# EAGLE design antenna_analyzer_rev7 (EAGLE 7.3.0)
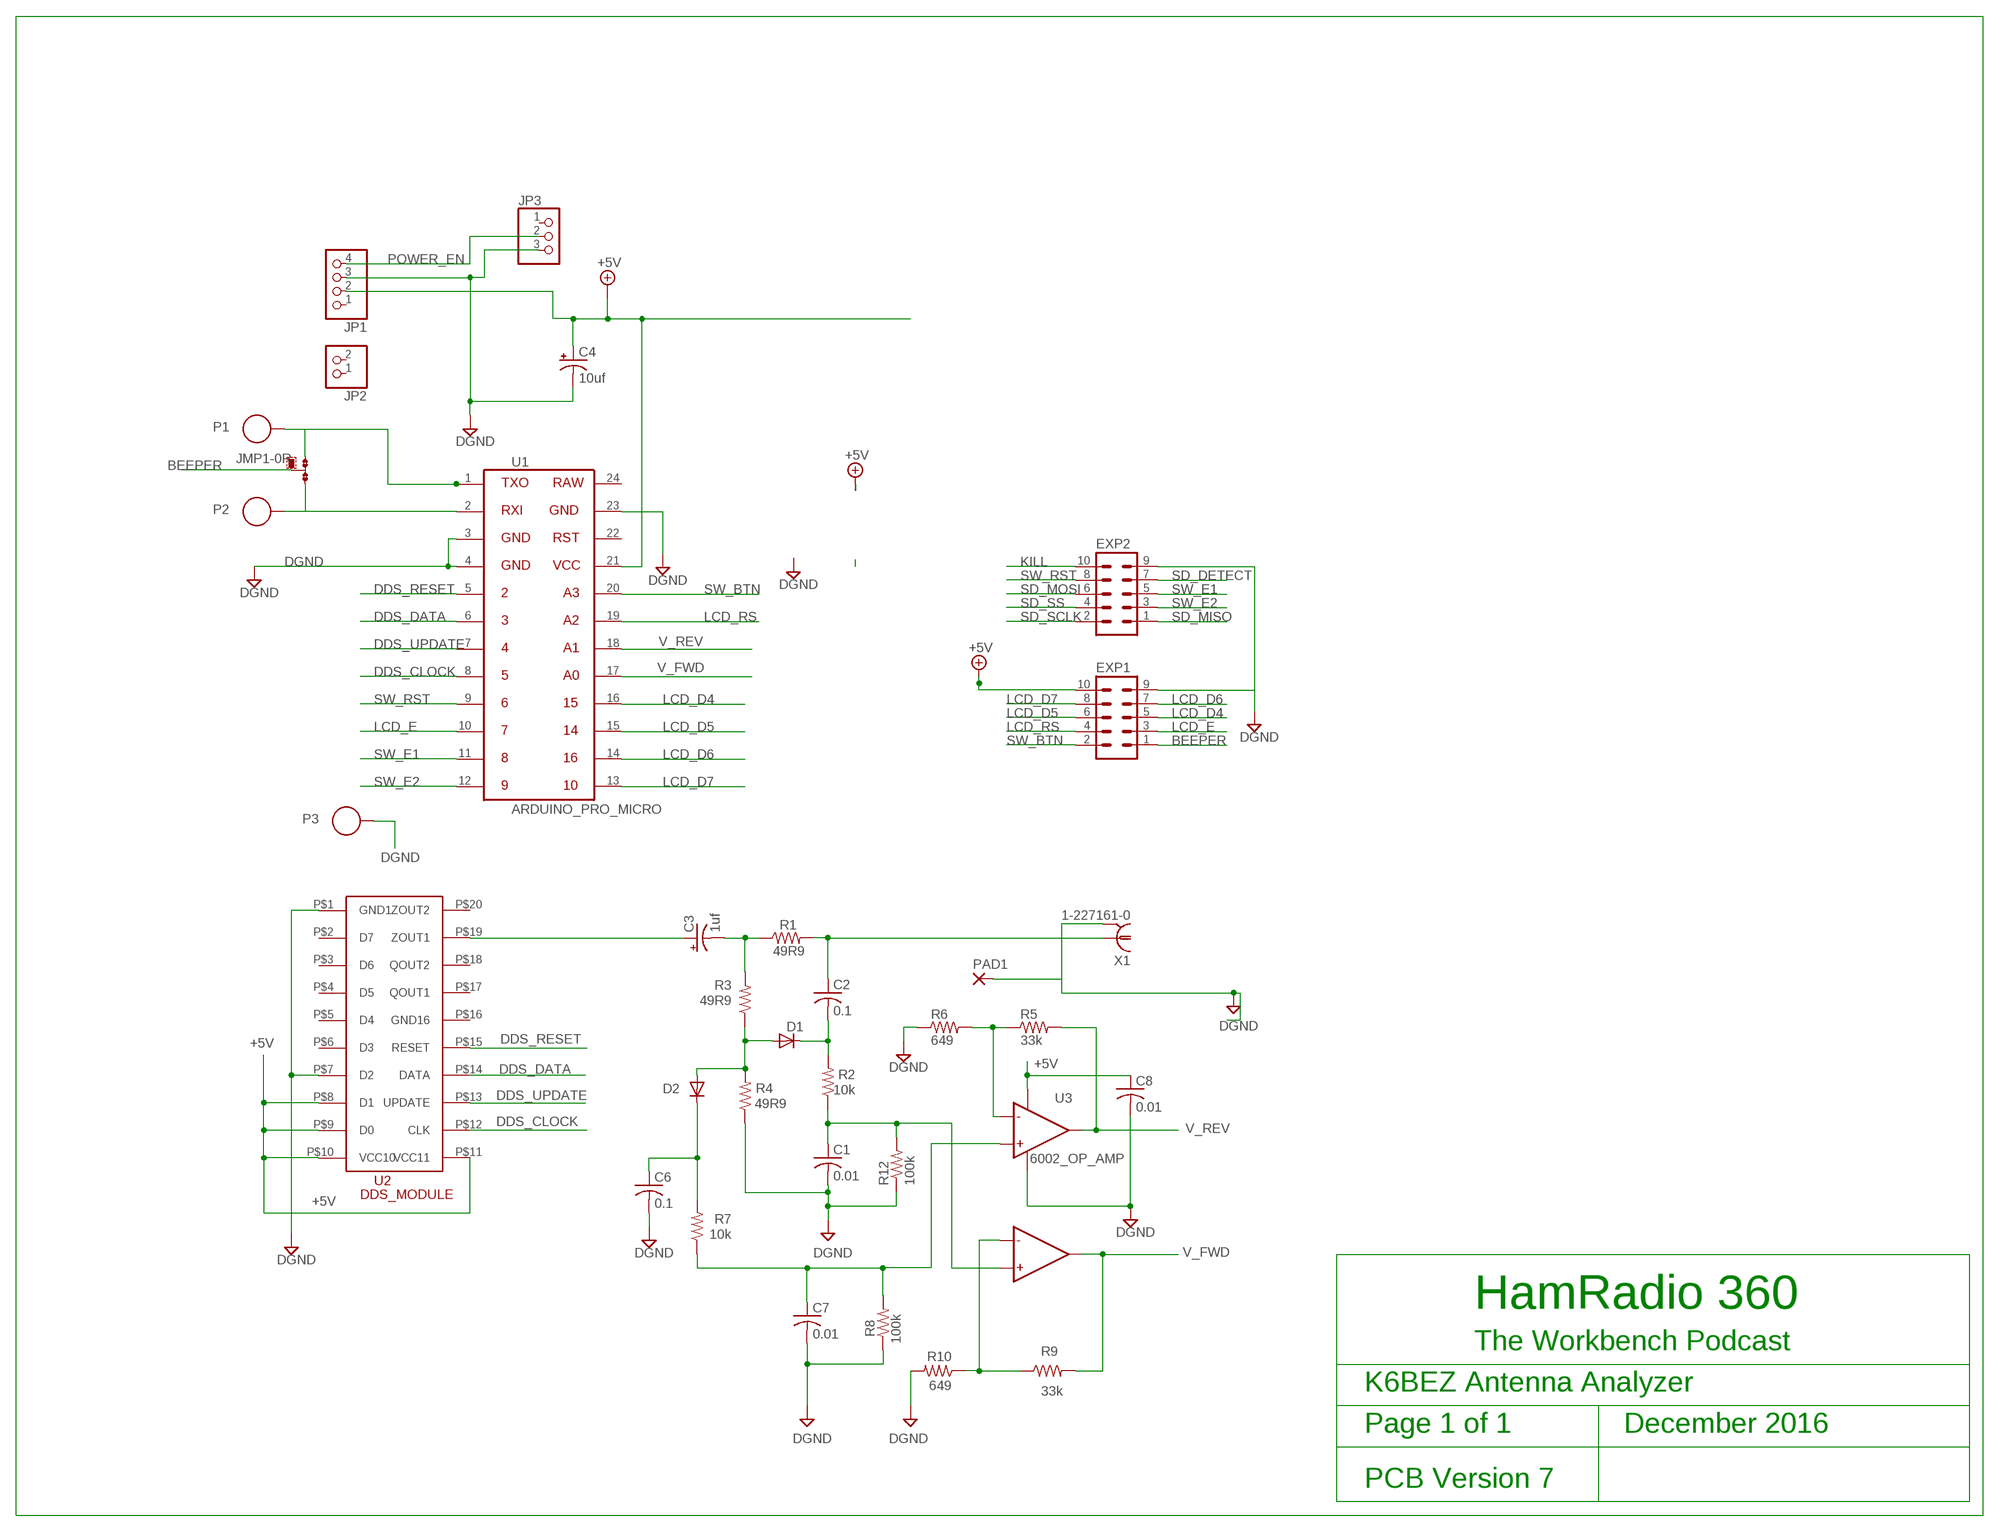
[diagram p0: schematic, sheet 1]

## Parts
C1  0.01  C-US025-025X050  [C025-025X050]
C2  0.1  C-US025-025X050  [C025-025X050]
C3  1uf  CPOL-USE1.8-4  [E1,8-4]
C4  10uf  CPOL-USE1.8-4  [E1,8-4]
C6  0.1  C-US025-025X050  [C025-025X050]
C7  0.01  C-US025-025X050  [C025-025X050]
C8  0.01  C-US025-025X050  [C025-025X050]
D1  AA143  1N4148DO35-7  [DO35-7]
D2  AA143  1N4148DO35-7  [DO35-7]
EXP1  MA05-2  [MA05-2]
EXP2  MA05-2  [MA05-2]
JMP1  0R-JUMPA  [A0R-JMP]
JP1  PINHD-1X4  [1X04]
JP2  PINHD-1X2  [1X02]
JP3  PINHD-1X3  [1X03]
P1  SOLDER_PAD_35_HOLE  [SOLDER_PAD_35_HOLE]
P2  SOLDER_PAD_35_HOLE  [SOLDER_PAD_35_HOLE]
P3  SOLDER_PAD_35_HOLE  [SOLDER_PAD_35_HOLE]
PAD1  1,6/0,9  [1,6/0,9]
R1  49R9  R-US_0207/10  [0207/10]
R2  10k  R-US_0207/10  [0207/10]
R3  49R9  R-US_0207/10  [0207/10]
R4  49R9  R-US_0207/10  [0207/10]
R5  33k  R-US_0207/10  [0207/10]
R6  649  R-US_0207/10  [0207/10]
R7  10k  R-US_0207/10  [0207/10]
R8  100k  R-US_0207/10  [0207/10]
R9  33k  R-US_0207/10  [0207/10]
R10  649  R-US_0207/10  [0207/10]
R12  100k  R-US_0207/10  [0207/10]
U1  ARDUINO_PRO_MICRO  [ARDUINO_PRO_MICRO]
U2  AD9850_MOD  [DDS_DIL]
U3  6002_OP_AMP  [OP_AMP_8_PIN]
X1  1-227161-0  [AMP_227161]

## Nets
+5V: C4.+ C8.1 EXP1.10 JP1.2 U1.21 U2.P$8(D1) U2.P$9(D0) U2.P$10(VCC10) U2.P$11(VCC11) U3.8(VCC+)
BEEPER: EXP1.1 JMP1.2
DDS_CLOCK: U1.8 U2.P$12(CLK)
DDS_DATA: U1.6 U2.P$14(DATA)
DDS_RESET: U1.5 U2.P$15(RESET)
DDS_UPDATE: U1.7 U2.P$13(UPDATE)
DGND: C1.2 C4.- C6.2 C7.2 C8.2 EXP1.9 EXP2.9 JP1.3 JP3.3 P3.1 PAD1.1(P) R4.1 R6.1 R8.1 R10.2 R12.1 U1.3 U1.4 U1.23 U2.P$1(GND1) U2.P$7(D2) U3.4(VCC-) X1.2
KILL: EXP2.10
LCD_D4: EXP1.5 U1.16
LCD_D5: EXP1.6 U1.15
LCD_D6: EXP1.7 U1.14
LCD_D7: EXP1.8 U1.13
LCD_E: EXP1.3 U1.10
LCD_RS: EXP1.4 U1.19
N$1: JMP1.1 P1.1 U1.1
N$2: C6.1 D2.C R7.2
N$3: C3.+ U2.P$19(ZOUT1)
N$5: C3.- R1.1 R3.2
N$6: D1.A D2.A R3.1 R4.2
N$7: C2.1 R1.2 X1.1
N$8: JMP1.3 P2.1 U1.2
N$9: C2.2 D1.C R2.2
N$10: C1.1 R2.1 R12.2 U3.5(IN+2)
N$11: C7.1 R7.1 R8.2 U3.3(IN+1)
N$13: R9.1 R10.1 U3.6(IN-2)
N$17: R5.1 R6.2 U3.2(IN-1)
POWER_EN: JP1.4 JP3.2
SD_DETECT: EXP2.7
SD_MISO: EXP2.1
SD_MOSI: EXP2.6
SD_SCLK: EXP2.2
SD_SS: EXP2.4
SW_BTN: EXP1.2 U1.20
SW_E1: EXP2.5 U1.11
SW_E2: EXP2.3 U1.12
SW_RST: EXP2.8 U1.9
V_FWD: R9.2 U1.17 U3.7(OUT2)
V_REV: R5.2 U1.18 U3.1(OUT1)
Unconnected: JP1.1 JP2.1 JP2.2 JP3.1 U1.22 U1.24 U2.P$2(D7) U2.P$3(D6) U2.P$4(D5) U2.P$5(D4) U2.P$6(D3) U2.P$16(GND16) U2.P$17(QOUT1) U2.P$18(QOUT2) U2.P$20(ZOUT2)

## Notes on the sheet
- HamRadio 360
- The Workbench Podcast
- K6BEZ Antenna Analyzer
- Page 1 of 1              December 2016
- PCB Version 7

## Library data of the parts
C1 C2 C6-C8 = resistor:C-US: CAPACITOR, American symbol
C3 C4 = resistor:CPOL-US: POLARIZED CAPACITOR, American symbol
D1 D2 = diode:1N4148: DIODE high speed (Philips)
EXP1 EXP2 = con-lstb:MA05-2: PIN HEADER; OC_FARNELL: unknown; OC_NEWARK: unknown
JMP1 = jump-0r-smd:0R-JUMP: SMD 0R 0805 Jumper
JP1 = pinhead:PINHD-1X4: PIN HEADER
JP2 = pinhead:PINHD-1X2: PIN HEADER
JP3 = adafruit:PINHD-1X3: PIN HEADER
P1-P3 = srs_lib_4:SOLDER_PAD_35_HOLE
PAD1 = wirepad:1,6/0,9: THROUGH-HOLE PAD
R1-R10 R12 = adafruit:R-US_: RESISTOR, American symbol
U1 = srs_lib_4:ARDUINO_PRO_MICRO
U2 = BericLib:AD9850_MOD
U3 = srs_lib_4:6002_OP_AMP
X1 = con-coax:?227161*: JACK, RIGHT ANGLE, 50 OHM, PCB, BNC Source: amp_227161.pdf; MF: TYCO ELECTRONICS; MPN: 1-227161; OC_FARNELL: unknown; OC_NEWARK: 33B3200

## Board
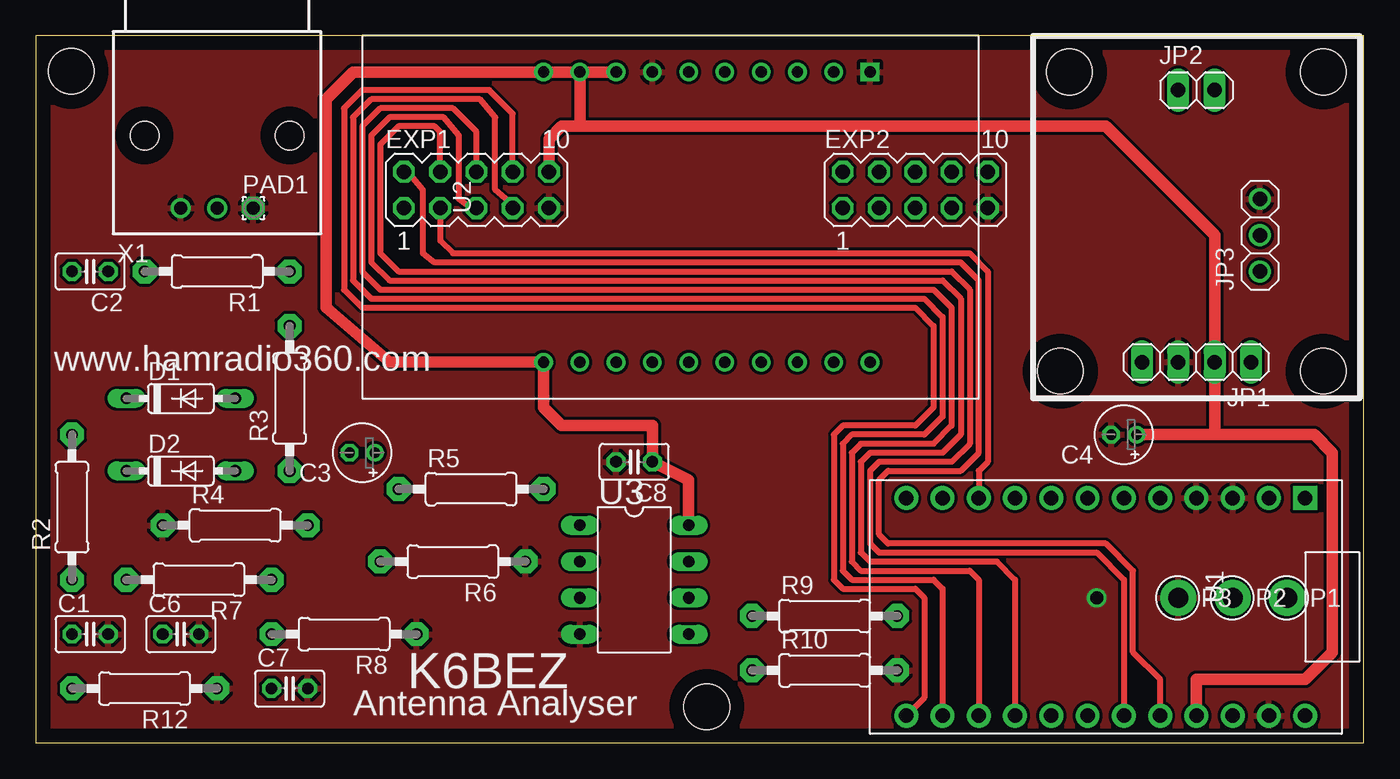
[diagram p1: board, top side]
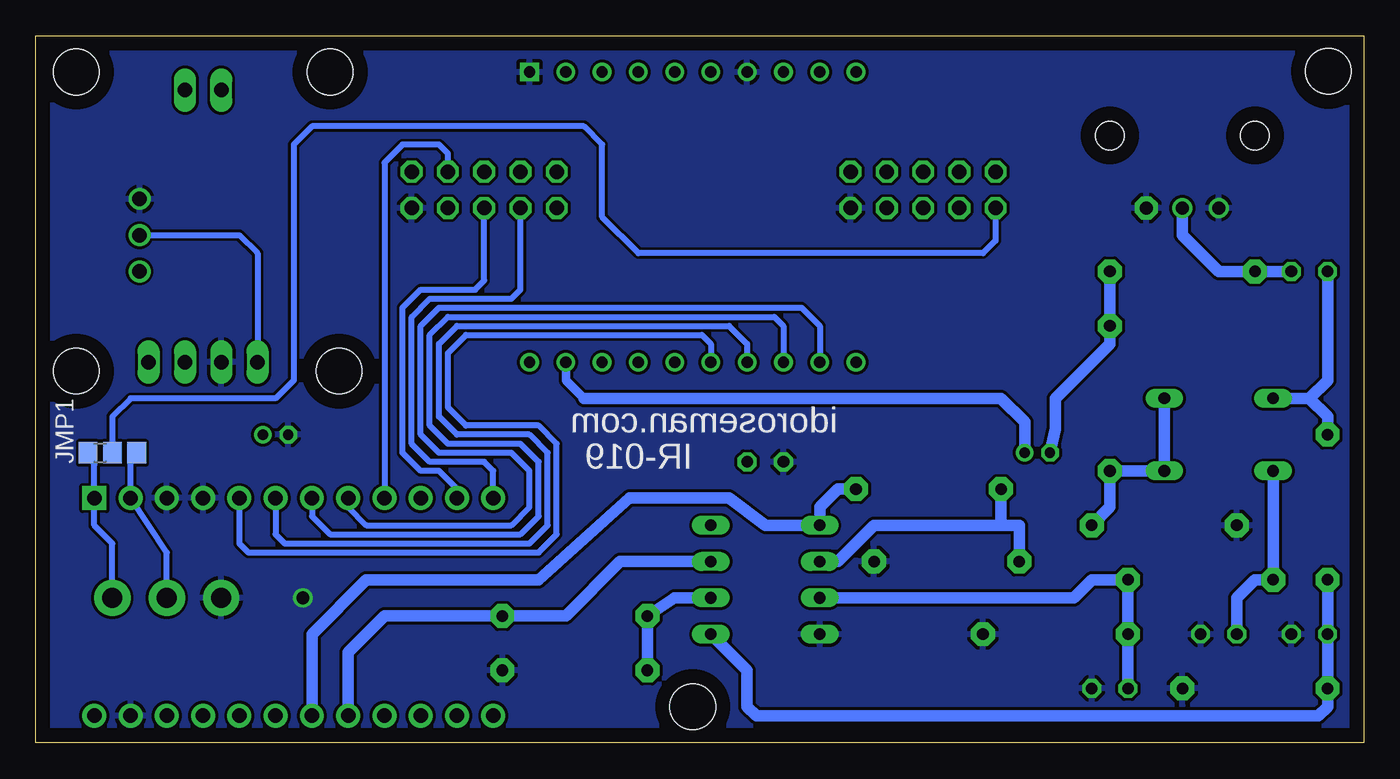
[diagram p2: board, bottom side, seen from below]

Size 93 x 49.53 mm. Coordinates in mm from the lower left corner, seen from the top.
Outline: 0,0 93,0 93,49.53 0,49.53 0,0
Copper layers (1*16): Top 0.035mm / dielectric 1.5mm / Bottom 0.035mm
Design rules "default": minimum track width 10mil, minimum drill 24mil, track to track 8mil, track to pad 8mil, pad to pad 8mil, via to via 8mil, smd to smd 8mil, copper to edge 40mil, drill to drill 8mil, minimum pad ring 10mil, minimum via ring 8mil, stop-mask expansion 4mil, vias tented up to drill 0mil, thermal gap 10mil
Holes 3.2 mm at 71.75,26.04 72.39,46.99 90.17,46.99 90.17,26.04 2.48,47.05 46.99,2.54

### Footprints (pad centres in the part's own frame; a part is rotated, then mirrored left to right if it is on the bottom)
C025-025X050 = drill 0.813 octagon: 1 -1.27,0; 2 1.27,0
E1,8-4 = drill 0.711 pad 1.168: + -0.889,0 | drill 0.711 pad 1.168 octagon: - 0.889,0
DO35-7 = drill 0.813 long: A 3.81,0; C -3.81,0
MA05-2 = drill 1.016 octagon: 1 -5.08,-1.27; 2 -5.08,1.27; 3 -2.54,-1.27; 4 -2.54,1.27; 5 0,-1.27; 6 0,1.27; 7 2.54,-1.27; 8 2.54,1.27; 9 5.08,-1.27; 10 5.08,1.27
A0R-JMP = smd 1.5 x 1.3: 1 0,1.7; 2 0,0; 3 0,-1.7
1X04 = drill 1.016 long: 1 -3.81,0; 2 -1.27,0; 3 1.27,0; 4 3.81,0
1X02 = drill 1.016 long: 1 -1.27,0; 2 1.27,0
1X03 = drill 1.016: 1 -2.54,0; 2 0,0; 3 2.54,0
SOLDER_PAD_35_HOLE = drill 1.4 pad 2.54: 1 0,0
1,6/0,9 = drill 0.914 pad 1.6 octagon: 1 0,0
0207/10 = drill 0.813 pad 1.676 octagon: 1 -5.08,0; 2 5.08,0
ARDUINO_PRO_MICRO = drill 1.016 pad 1.676 square: 1 0,0 | drill 1.016 pad 1.676: 2 0,-2.54; 3 0,-5.08; 4 0,-7.62; 5 0,-10.16; 6 0,-12.7; 7 0,-15.24; 8 0,-17.78; 9 0,-20.32; 10 0,-22.86; 11 0,-25.4; 12 0,-27.94; 13 15.24,-27.94; 14 15.24,-25.4; 15 15.24,-22.86; 16 15.24,-20.32; 17 15.24,-17.78; 18 15.24,-15.24; 19 15.24,-12.7; 20 15.24,-10.16; 21 15.24,-7.62; 22 15.24,-5.08; 23 15.24,-2.54; 24 15.24,0
DDS_DIL = drill 0.8 square: P$1 -6.35,6.35 | drill 0.8: P$2 -6.35,3.81; P$3 -6.35,1.27; P$4 -6.35,-1.27; P$5 -6.35,-3.81; P$6 -6.35,-6.35; P$7 -6.35,-8.89; P$8 -6.35,-11.43; P$9 -6.35,-13.97; P$10 -6.35,-16.51; P$11 13.97,-16.51; P$12 13.97,-13.97; P$13 13.97,-11.43; P$14 13.97,-8.89; P$15 13.97,-6.35; P$16 13.97,-3.81; P$17 13.97,-1.27; P$18 13.97,1.27; P$19 13.97,3.81; P$20 13.97,6.35
OP_AMP_8_PIN = drill 0.813 long: 1 -3.81,-3.81; 2 -1.27,-3.81; 3 1.27,-3.81; 4 3.81,-3.81; 5 3.81,3.81; 6 1.27,3.81; 7 -1.27,3.81; 8 -3.81,3.81
AMP_227161 = drill 0.9 pad 1.27: 1 0,-5.08; 2 -2.54,-5.08 | hole 2: -5.08,0; 5.08,0

### Placement (x,y rotation side)
C1  3.81,7.62 0 top
C2  3.81,33.02 180 top
C3  22.86,20.32 180 top
C4  76.2,21.59 180 top
C6  10.16,7.62 0 top
C7  17.78,3.81 0 top
C8  41.91,19.68 180 top
D1  10.16,24.13 0 top
D2  10.16,19.05 0 top
EXP1  30.86,38.73 0 top
EXP2  61.59,38.73 0 top
JMP1  87.63,20.32 90 bottom
JP1  81.28,26.67 180 top
JP2  81.28,45.72 0 top
JP3  85.72,35.56 90 top
P1  87.63,10.16 0 top
P2  83.82,10.16 0 top
P3  80.01,10.16 0 top
PAD1  15.24,37.47 0 top
R1  12.7,33.02 180 top
R2  2.54,16.51 90 top
R3  17.78,24.13 90 top
R4  13.97,15.24 0 top
R5  30.48,17.78 0 top
R6  29.21,12.7 180 top
R7  11.43,11.43 180 top
R8  21.59,7.62 180 top
R9  55.24,8.89 0 top
R10  55.24,5.08 0 top
R12  7.62,3.81 180 top
U1  88.9,17.14 270 top
U2  52.07,40.64 270 top
U3  41.91,11.43 270 top
X1  12.7,42.55 0 top

### Tracks (layer width: path | path; a pad name or v marks a point on that pad's centre or on a via)
+5V
  Top 0.813: U2.P$8 U2.P$9 | U2.P$9 U2.P$10 22.23,46.99 20.32,45.09 20.32,30.48 24.77,26.67 U2.P$11 35.56,23.5 36.83,22.23 43.18,22.23 C8.1 45.72,18.41 U3.8 | U2.P$9 38.1,43.18 | 38.1,43.18 74.93,43.18 82.55,35.56 JP1.2 82.55,21.59 | 82.55,21.59 89.53,21.59 90.81,20.32 90.81,6.35 88.9,4.45 81.28,4.45 U1.21 | C4.+ 82.55,21.59 | EXP1.10 35.94,42.29 36.83,43.18 38.1,43.18
BEEPER
  Bottom 0.406: EXP1.1 25.78,35.18 26.67,34.29 50.8,34.29 53.34,36.83 53.34,41.91 54.61,43.18 73.66,43.18 74.93,41.91 74.93,25.4 76.2,24.13 86.36,24.13 87.63,22.86 JMP1.2
DDS_CLOCK
  Bottom 0.406: U1.8 71.12,16.51 69.85,15.24 59.69,15.24 58.42,16.51 58.42,19.05 59.69,20.32 64.77,20.32 66.04,21.59 66.04,29.21 64.77,30.48 39.37,30.48 38.1,29.21 U2.P$12
DDS_DATA
  Bottom 0.406: U1.6 76.2,14.61 75.56,13.97 58.42,13.97 57.15,15.24 57.15,20.32 58.42,21.59 63.5,21.59 64.77,22.86 64.77,27.94 63.5,29.21 44.45,29.21 43.18,27.94 U2.P$14
DDS_RESET
  Bottom 0.406: U1.5 78.74,13.97 78.11,13.34 57.78,13.34 56.52,14.61 56.52,20.95 57.78,22.23 62.87,22.23 64.14,23.5 64.14,27.3 62.87,28.57 46.35,28.57 45.72,27.94 U2.P$15
DDS_UPDATE
  Bottom 0.406: U1.7 73.66,15.88 72.39,14.61 59.05,14.61 57.78,15.88 57.78,19.68 59.05,20.95 64.14,20.95 65.41,22.23 65.41,28.57 64.14,29.84 41.27,29.84 40.64,29.21 U2.P$13
DGND  (via drill 0.9)
  other vias: 74.3,10.16
  pour Bottom: 0,0 0,49.53 92.71,49.53 92.71,0
  pour Top: 0,0 0,49.53 92.71,49.53 92.71,0
LCD_D4
  Top 0.406: EXP1.5 30.48,37.47 29.64,38.1 29.64,42.55 28.57,43.81 24.77,43.81 23.5,42.55 23.5,33.66 24.77,32.38 63.5,32.38 64.77,31.11 64.77,21.59 63.5,20.32 58.42,20.32 57.78,19.68 57.78,13.34 58.42,12.7 67.31,12.7 68.58,11.43 U1.16
LCD_D5
  Top 0.406: EXP1.6 30.86,42.8 29.21,44.45 24.13,44.45 22.86,43.18 22.86,33.02 24.13,31.75 62.87,31.75 64.14,30.48 64.14,22.23 62.87,20.95 57.78,20.95 57.15,20.32 57.15,12.7 57.78,12.06 65.41,12.06 66.04,11.43 U1.15
LCD_D6
  Top 0.406: EXP1.7 33.4,37.72 32.18,38.73 32.18,43.81 31.11,45.09 23.5,45.09 22.23,43.81 22.23,32.38 23.5,31.11 62.23,31.11 63.5,29.84 63.5,22.86 62.23,21.59 57.15,21.59 56.52,20.95 56.52,12.06 57.15,11.43 62.87,11.43 63.5,10.79 U1.14
LCD_D7
  Top 0.406: EXP1.8 33.4,44.07 31.75,45.72 22.86,45.72 21.59,44.45 21.59,31.75 22.86,30.48 61.59,30.48 62.87,29.21 62.87,23.5 61.59,22.23 56.52,22.23 55.88,21.59 55.88,11.43 56.52,10.79 61.59,10.79 62.23,10.16 62.23,3.17 U1.13
LCD_E
  Top 0.406: EXP1.3 28.32,35.18 29.21,34.29 65.41,34.29 66.67,33.02 66.67,19.68 66.04,19.05 U1.10
LCD_RS
  Top 0.406: EXP1.4 28.32,42.8 27.94,43.18 25.4,43.18 24.13,41.91 24.13,34.29 25.4,33.02 64.14,33.02 65.41,31.75 65.41,20.95 64.14,19.68 59.05,19.68 58.42,19.05 58.42,13.97 59.05,13.34 74.3,13.34 76.2,11.43 U1.19
N$1
  Bottom 0.406: P1.1 87.63,13.97 88.9,15.24 U1.1 88.9,19.48 JMP1.1
N$2
  Bottom 0.813: D2.C R7.2 7.62,11.43 8.89,10.16 C6.1
N$3
  Bottom 0.61: U2.P$19 55.88,25.4 54.61,24.13
  Bottom 0.813: C3.+ 23.75,22.48 25.4,24.13 54.61,24.13
N$5
  Bottom 0.813: R1.1 R3.2 17.78,27.94 21.59,24.13 21.59,21.97 C3.-
N$6
  Bottom 0.813: D1.A D2.A R3.1 17.78,16.51 R4.2
N$7
  Bottom 0.813: X1.1 12.7,35.56 10.16,33.02 R1.2 C2.1
N$8
  Bottom 0.406: P2.1 83.82,13.34 U1.2 86.36,19.89 JMP1.3
N$9
  Bottom 0.813: C2.2 2.54,25.4 3.81,24.13 | 3.81,24.13 D1.C | R2.2 2.54,22.86 3.81,24.13
N$10
  Bottom 0.813: R2.1 C1.1 R12.2 2.54,2.54 3.17,1.91 42.55,1.91 43.18,2.54 43.18,5.08 U3.5
N$11
  Bottom 0.813: C7.1 R8.2 R7.1 19.05,11.43 20.32,10.16 U3.3
N$13
  Bottom 0.813: R10.1 R9.1 48.26,10.16 U3.6
N$17
  Bottom 0.813: U3.2 36.83,12.7 34.29,15.24 25.4,15.24 | 25.4,15.24 24.13,15.24 R6.2 | R5.1 25.4,15.24
POWER_EN
  Bottom 0.406: JP3.2 78.74,35.56 77.47,34.29 JP1.4
SW_BTN
  Top 0.406: U1.20 78.74,4.45 76.83,6.35 76.83,12.06 74.93,13.97 59.69,13.97 59.05,14.61 59.05,18.41 59.69,19.05 64.77,19.05 66.04,20.32 66.04,32.38 64.77,33.66 27.94,33.66 27.1,34.29 27.1,38.73 26.04,40.01 EXP1.2
SW_E1
  Bottom 0.406: U1.11 63.5,17.78 64.77,19.05 66.04,19.05 67.31,20.32 67.31,30.48 66.04,31.75 62.23,31.75 61.59,32.38 EXP2.5
SW_E2
  Bottom 0.406: U1.12 60.96,19.05 61.59,19.68 65.41,19.68 66.67,20.95 66.67,29.84 65.41,31.11 59.69,31.11 59.05,31.75 EXP2.3
SW_RST
  Bottom 0.406: EXP2.8 64.14,41.27 64.77,41.91 67.31,41.91 68.58,40.64 U1.9
V_FWD
  Bottom 0.813: U3.7 52.07,12.7 55.88,8.89 R9.2 68.58,8.89 71.12,6.35 U1.17
V_REV
  Bottom 0.813: U1.18 73.66,7.62 69.85,11.43 57.78,11.43 51.44,17.14 44.45,17.14 41.91,15.24 U3.1 38.1,16.51 36.83,17.78 R5.2

### Text on the board
tNames: www.hamradio360.com | K6BEZ | Antenna Analyser
bNames: idoroseman.com | IR-019